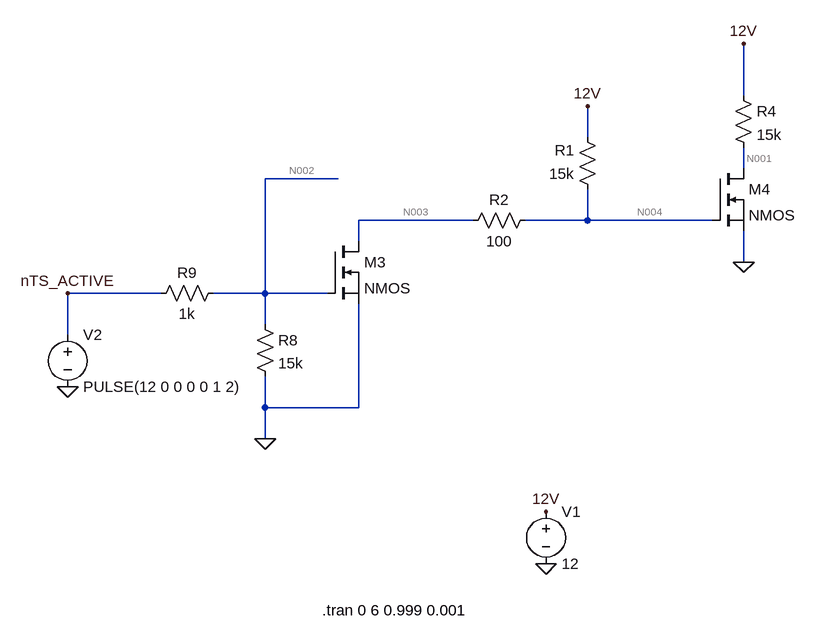
[diagram p0: schematic TSActive.asc]
TSActive.asc, the LTspice schematic file:
Version 4
SHEET 1 1016 680
WIRE -32 -288 -32 -368
WIRE -272 -224 -272 -272
WIRE -32 -176 -32 -208
WIRE -656 -160 -768 -160
WIRE -448 -96 -624 -96
WIRE -272 -96 -272 -144
WIRE -272 -96 -368 -96
WIRE -80 -96 -272 -96
WIRE -624 -64 -624 -96
WIRE -32 -32 -32 -80
WIRE -928 16 -1072 16
WIRE -768 16 -768 -160
WIRE -768 16 -848 16
WIRE -672 16 -768 16
WIRE -768 64 -768 16
WIRE -1072 80 -1072 16
WIRE -768 192 -768 144
WIRE -624 192 -624 32
WIRE -624 192 -768 192
WIRE -768 240 -768 192
FLAG -336 432 0
FLAG -336 352 12V
FLAG -1072 160 0
FLAG -272 -272 12V
FLAG -768 240 0
FLAG -1072 16 nTS_ACTIVE
FLAG -32 -32 0
FLAG -32 -368 12V
SYMBOL voltage -336 336 R0
WINDOW 123 0 0 Left 2
WINDOW 39 0 0 Left 2
SYMATTR InstName V1
SYMATTR Value 12
SYMBOL voltage -1072 64 R0
WINDOW 123 0 0 Left 2
WINDOW 39 0 0 Left 2
SYMATTR InstName V2
SYMATTR Value PULSE(12 0 0 0 0 1 2)
SYMBOL nmos -672 -64 R0
SYMATTR InstName M3
SYMBOL nmos -80 -176 R0
SYMATTR InstName M4
SYMBOL res -256 -128 R180
WINDOW 0 36 76 Left 2
WINDOW 3 36 40 Left 2
SYMATTR InstName R1
SYMATTR Value 15k
SYMBOL res -352 -112 R90
WINDOW 0 0 56 VBottom 2
WINDOW 3 32 56 VTop 2
SYMATTR InstName R2
SYMATTR Value 100
SYMBOL res -784 48 R0
SYMATTR InstName R8
SYMATTR Value 15k
SYMBOL res -832 0 R90
WINDOW 0 0 56 VBottom 2
WINDOW 3 32 56 VTop 2
SYMATTR InstName R9
SYMATTR Value 1k
SYMBOL res -48 -304 R0
SYMATTR InstName R4
SYMATTR Value 15k
TEXT -680 504 Left 2 !.tran 0 6 0.999 0.001

The netlist it stands for:
* TSActive.asc
V1 12V 0 12
V2 nTS_ACTIVE 0 PULSE(12 0 0 0 0 1 2)
M3 N003 N002 0 0 NMOS
M4 N001 N004 0 0 NMOS
R1 N004 12V 15k
R2 N004 N003 100
R8 N002 0 15k
R9 N002 nTS_ACTIVE 1k
R4 12V N001 15k
.model NMOS NMOS
.model PMOS PMOS
.lib standard.mos
.tran 0 6 0.999 0.001
.backanno
.end

* Results of the author's LTspice run, read from the files saved beside the schematic
* Operating Point, zero values left out:
*   V(12v) = 12 V
*   V(nts_active) = 12 V
*   V(n003) = 3.048 V
*   V(n002) = 11.25 V
*   V(n001) = 10.55 V
*   V(n004) = 3.107 V
*   Id(M4) = 96.54 µA
*   Ib(M4) = -10.56 pA
*   Is(M4) = -96.54 µA
*   Id(M3) = 592.9 µA
*   Ib(M3) = -3.058 pA
*   Is(M3) = -592.9 µA
*   I(R4) = 96.54 µA
*   I(R9) = -750 µA
*   I(R8) = 750 µA
*   I(R2) = 592.9 µA
*   I(R1) = -592.9 µA
*   I(V2) = -750 µA
*   I(V1) = -689.4 µA
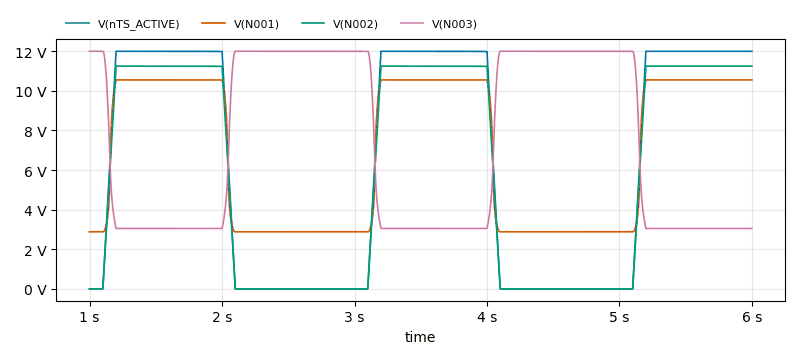
[diagram p1: Transient Analysis of TSActive.asc, plotted from the saved traces]
* Transient Analysis, 1 run:
*   V(nTS_ACTIVE): min 0 V, max 12 V, average 6.357 V, rms 8.594 V, last 12 V
*   V(N001): min 2.879 V, max 10.55 V, average 6.886 V, rms 7.845 V, last 10.55 V
*   V(N002): min 0 V, max 11.25 V, average 5.959 V, rms 8.057 V, last 11.25 V
*   V(N003): min 3.048 V, max 12 V, average 7.245 V, rms 8.456 V, last 3.048 V